# Altium schematic sheet Sheet2.SchDoc
size 431 x 279 mm; SheetNumber: 1; SheetTotal: 1
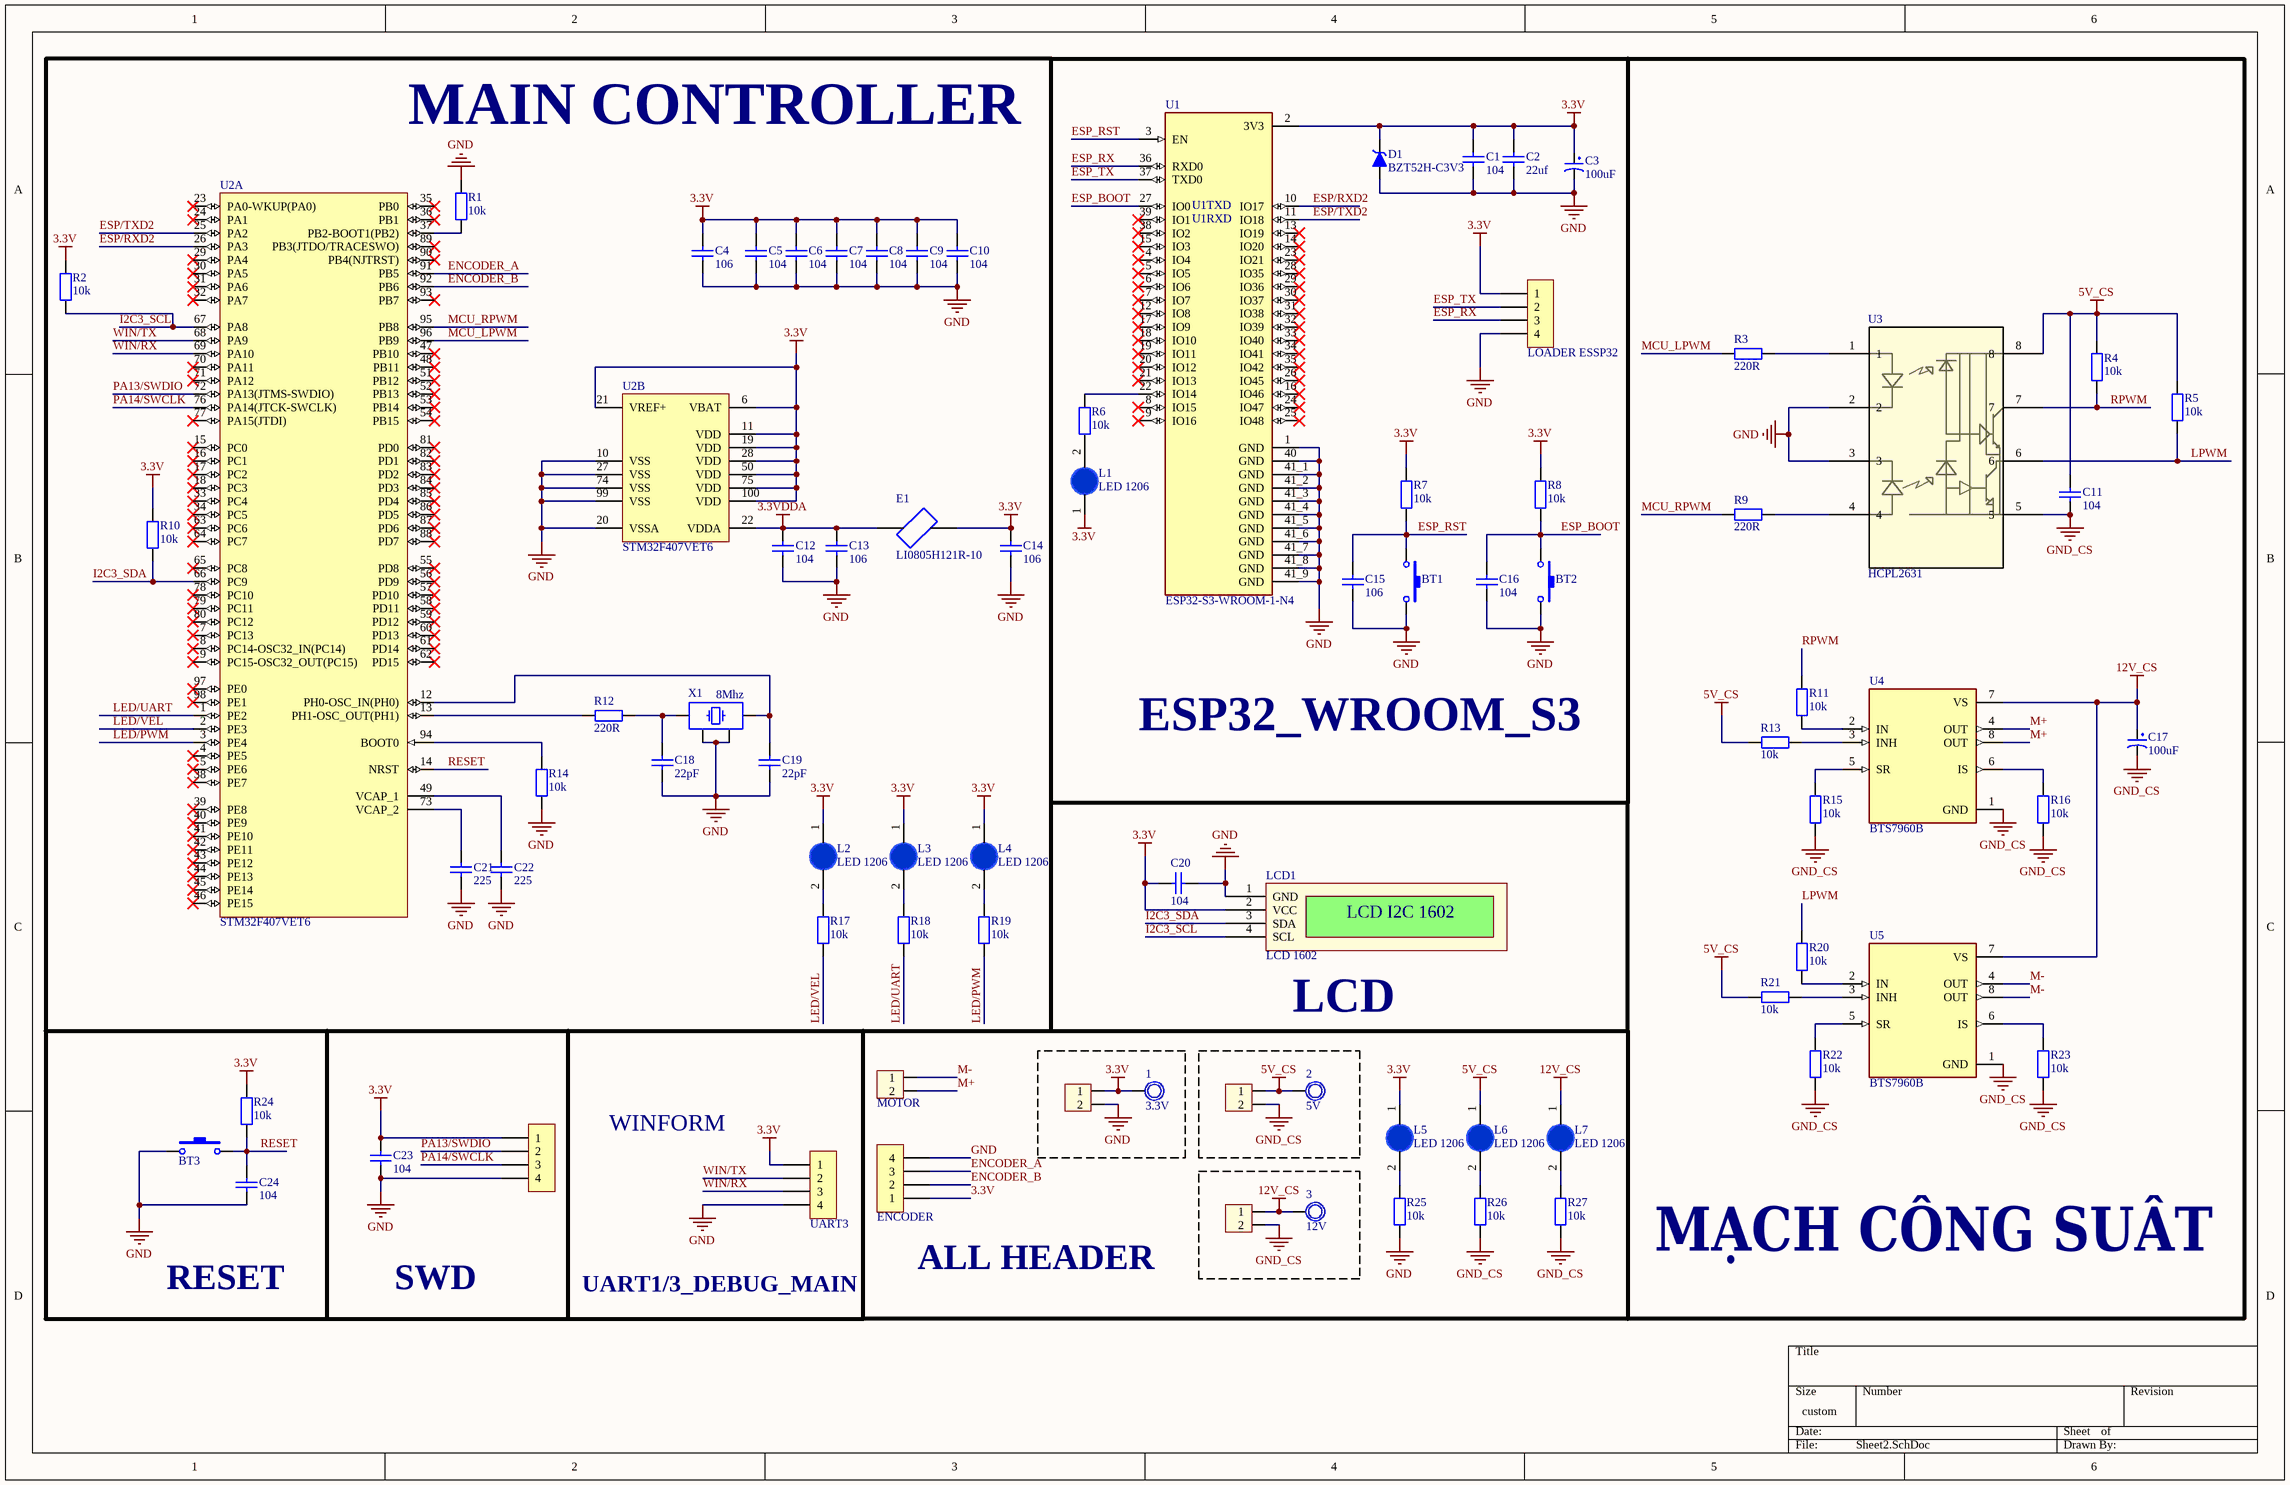
[diagram p0: Sheet2.SchDoc]

## Parts
1  3.3V  [TP1]
2  5V  [TP1]
3  12V  [TP1]
BT1  Nut Nhan 2 Chan SMD 3x6x2.5  [Nut Nhan 2 Chan SMD 3x6x2.5]  (value not drawn)
BT2  Nut Nhan 2 Chan SMD 3x6x2.5  [Nut Nhan 2 Chan SMD 3x6x2.5]  (value not drawn)
BT3  Nut Nhan 2 Chan SMD 3x6x2.5  [Nut Nhan 2 Chan SMD 3x6x2.5]  (value not drawn)
C1  104  [tu 0805]
C2  22uf  [tu 0805]
C3  100uF  [tu tantalum smd7343]
C4  106  [tu 0805]
C5  104  [tu 0805]
C6  104  [tu 0805]
C7  104  [tu 0805]
C8  104  [tu 0805]
C9  104  [tu 0805]
C10  104  [tu 0805]
C11  104  [tu 0805]
C12  104  [tu 0805]
C13  106  [tu 0805]
C14  106  [tu 0805]
C15  106  [tu 0805]
C16  104  [tu 0805]
C17  100uF  [tu hoa 8mm]
C18  22pF  [tu 0805]
C19  22pF  [tu 0805]
C20  104  [tu 0805]
C21  225  [tu 0805]
C22  225  [tu 0805]
C23  104  [tu 0805]
C24  104  [tu 0805]
D1  BZT52H-C3V3  [SOD123]
E1  LI0805H121R-10  [FB_LI0805H121R-10]
H1  LOADER ESSP32  [XH2.54M-4]
H2  MOTOR  [XH2.54M-2]
H3  Header 2P 2.54 Duc Thang  [XH2.54M-2]  (value not drawn)
H4  Header 2P 2.54 Duc Thang  [XH2.54M-2]  (value not drawn)
H5  Header 4P 2.54 Duc Thang  [XH2.54M-4]  (value not drawn)
H6  ENCODER  [XH2.54M-4]
H7  UART3  [XH2.54M-4]
H8  Header 2P 2.54 Duc Thang  [XH2.54M-2]  (value not drawn)
L1  LED 1206  [LED-1206-Blue]
L2  LED 1206  [LED-1206-Blue]
L3  LED 1206  [LED-1206-Blue]
L4  LED 1206  [LED-1206-Blue]
L5  LED 1206  [LED-1206-Blue]
L6  LED 1206  [LED-1206-Blue]
L7  LED 1206  [LED-1206-Blue]
LCD1  LCD 1602  [LCD-I2C-1602]
R1  10k  [tro smd 0805]
R2  10k  [tro smd 0805]
R3  220R  [tro smd 0805]
R4  10k  [tro smd 0805]
R5  10k  [tro smd 0805]
R6  10k  [tro smd 0805]
R7  10k  [tro smd 0805]
R8  10k  [tro smd 0805]
R9  220R  [tro smd 0805]
R10  10k  [tro smd 0805]
R11  10k  [tro smd 0805]
R12  220R  [tro smd 0805]
R13  10k  [tro smd 0805]
R14  10k  [tro smd 0805]
R15  10k  [tro smd 0805]
R16  10k  [tro smd 0805]
R17  10k  [tro smd 0805]
R18  10k  [tro smd 0805]
R19  10k  [tro smd 0805]
R20  10k  [tro smd 0805]
R21  10k  [tro smd 0805]
R22  10k  [tro smd 0805]
R23  10k  [tro smd 0805]
R24  10k  [tro smd 0805]
R25  10k  [tro smd 0805]
R26  10k  [tro smd 0805]
R27  10k  [tro smd 0805]
U1  ESP32-S3-WROOM-1-N4  [XCVR_ESP32-S3-WROOM-1-N4]
U2  STM32F407VET6  [STM-LQFP100_N]  (parts A,B of 2)
U3  HCPL2631  [DIP_PL2631_ONS]
U4  BTS7960B  [DPAK127P1490X440-8N]
U5  BTS7960B  [DPAK127P1490X440-8N]
X1  8Mhz  [XTAL_3225]

## Nets
3.3V: 1.1 C1.1 C2.2 C3.1 C4.1 C5.1 C6.1 C7.1 C8.1 C9.1 C10.1 C14.1 C20.1 C23.1 D1.2(K) E1.2 H1.1 H3.1 H5.1 H6.1 H7.1 L1.1(A) L2.1(A) L3.1(A) L4.1(A) L5.1(A) LCD1.2(VCC) R2.1 R7.2 R8.2 R10.2 R24.2 U1.2(3V3) U2.6(VBAT) U2.11(VDD) U2.19(VDD) U2.21(VREF+) U2.28(VDD) U2.50(VDD) U2.75(VDD) U2.100(VDD)
3.3VDDA: C12.1 C13.1 E1.1 U2.22(VDDA)
5V_CS: 2.1 C11.1 H4.1 L6.1(A) R4.2 R5.2 R13.2 R21.2 U3.8
12V_CS: 3.1 C17.1 H8.1 L7.1(A) U4.7(VS) U5.7(VS)
GND: BT1.2 BT2.2 BT3.1 C1.2 C2.1 C3.2 C4.2 C5.2 C6.2 C7.2 C8.2 C9.2 C10.2 C12.2 C13.2 C14.2 C15.2 C16.2 C18.2 C19.2 C20.2 C21.2 C22.2 C23.2 C24.2 D1.1(A) H1.4 H3.2 H5.4 H6.4 H7.4 LCD1.1(GND) R1.1 R14.1 R25.1 U1.1(GND) U1.40(GND) U1.41_1(GND) U1.41_2(GND) U1.41_3(GND) U1.41_4(GND) U1.41_5(GND) U1.41_6(GND) U1.41_7(GND) U1.41_8(GND) U1.41_9(GND) U2.10(VSS) U2.20(VSSA) U2.27(VSS) U2.74(VSS) U2.99(VSS) U3.2 U3.3 X1.2 X1.4
GND_CS: C11.2 C17.2 H4.2 H8.2 R15.2 R16.2 R22.2 R23.2 R26.1 R27.1 U3.5 U4.1(GND) U5.1(GND)
ENCODER_A: H6.3 U2.91(PB5)
ENCODER_B: H6.2 U2.92(PB6)
ESP/RXD2: U1.10(IO17) U2.26(PA3)
ESP/TXD2: U1.11(IO18) U2.25(PA2)
ESP_BOOT: BT2.1 C16.1 R8.1 U1.27(IO0)
ESP_RST: BT1.1 C15.1 R7.1 U1.3(EN)
ESP_RX: H1.3 U1.36(RXD0)
ESP_TX: H1.2 U1.37(TXD0)
I2C3_SCL: LCD1.4(SCL) R2.2 U2.67(PA8)
I2C3_SDA: LCD1.3(SDA) R10.1 U2.66(PC9)
LED/PWM: R19.1 U2.3(PE4)
LED/UART: R18.1 U2.1(PE2)
LED/VEL: R17.1 U2.2(PE3)
LPWM: R5.1 R20.2 U3.6
M+: H2.2 U4.4(OUT) U4.8(OUT)
M-: H2.1 U5.4(OUT) U5.8(OUT)
MCU_LPWM: R3.1 U2.96(PB9)
MCU_RPWM: R9.1 U2.95(PB8)
PA13/SWDIO: H5.2 U2.72(PA13(JTMS-SWDIO))
PA14/SWCLK: H5.3 U2.76(PA14(JTCK-SWCLK))
RESET: BT3.2 C24.1 R24.1 U2.14(NRST)
RPWM: R4.1 R11.2 U3.7
WIN/RX: H7.3 U2.69(PA10)
WIN/TX: H7.2 U2.68(PA9)
NetC18_1: C18.1 R12.2 X1.1
NetC19_1: C19.1 U2.12(PH0-OSC_IN(PH0)) X1.3
NetC21_1: C21.1 U2.73(VCAP_2)
NetC22_1: C22.1 U2.49(VCAP_1)
NetL1_2: L1.2(K) R6.2
NetL2_2: L2.2(K) R17.2
NetL3_2: L3.2(K) R18.2
NetL4_2: L4.2(K) R19.2
NetL5_2: L5.2(K) R25.2
NetL6_2: L6.2(K) R26.2
NetL7_2: L7.2(K) R27.2
NetR1_2: R1.2 U2.37(PB2-BOOT1(PB2))
NetR3_2: R3.2 U3.1
NetR6_1: R6.1 U1.22(IO14)
NetR9_2: R9.2 U3.4
NetR11_1: R11.1 U4.2(IN)
NetR12_1: R12.1 U2.13(PH1-OSC_OUT(PH1))
NetR13_1: R13.1 U4.3(INH)
NetR14_2: R14.2 U2.94(BOOT0)
NetR15_1: R15.1 U4.5(SR)
NetR16_1: R16.1 U4.6(IS)
NetR20_1: R20.1 U5.2(IN)
NetR21_1: R21.1 U5.3(INH)
NetR22_1: R22.1 U5.5(SR)
NetR23_1: R23.1 U5.6(IS)

Not connected (* = marked no-connect by the designer): U1 4(IO4)* 5(IO5)* 6(IO6)* 7(IO7)* 8(IO15)* 9(IO16)* 12(IO8)* 13(IO19)* 14(IO20)* 15(IO3)* 16(IO46)* 17(IO9)* 18(IO10)* 19(IO11)* 20(IO12)* 21(IO13)* 23(IO21)* 24(IO47)* 25(IO48)* 26(IO45)* 28(IO35)* 29(IO36)* 30(IO37)* 31(IO38)* 32(IO39)* 33(IO40)* 34(IO41)* 35(IO42)* 38(IO2)* 39(IO1)*; U2 4(PE5)* 5(PE6)* 7(PC13)* 8(PC14-OSC32_IN(PC14))* 9(PC15-OSC32_OUT(PC15))* 15(PC0)* 16(PC1)* 17(PC2)* 18(PC3)* 23(PA0-WKUP(PA0))* 24(PA1)* 29(PA4)* 30(PA5)* 31(PA6)* 32(PA7)* 33(PC4)* 34(PC5)* 35(PB0)* 36(PB1)* 38(PE7)* 39(PE8)* 40(PE9)* 41(PE10)* 42(PE11)* 43(PE12)* 44(PE13)* 45(PE14)* 46(PE15)* 47(PB10)* 48(PB11)* 51(PB12)* 52(PB13)* 53(PB14)* 54(PB15)* 55(PD8)* 56(PD9)* 57(PD10)* 58(PD11)* 59(PD12)* 60(PD13)* 61(PD14)* 62(PD15)* 63(PC6)* 64(PC7)* 65(PC8)* 70(PA11)* 71(PA12)* 77(PA15(JTDI))* 78(PC10)* 79(PC11)* 80(PC12)* 81(PD0)* 82(PD1)* 83(PD2)* 84(PD3)* 85(PD4)* 86(PD5)* 87(PD6)* 88(PD7)* 89(PB3(JTDO/TRACESWO))* 90(PB4(NJTRST))* 93(PB7)* 97(PE0)* 98(PE1)*

## Notes on the sheet
- MAIN CONTROLLER
- (near U1) U1TXD
- (near U1) U1RXD
- ESP32_WROOM_S3
- LCD
- WINFORM
- RESET
- SWD
- UART1/3_DEBUG_MAIN
- (near H6) ALL HEADER
- MẠCH CÔNG SUẤT
- (in symbol LCD 1602) LCD I2C 1602

## Library data of the parts
1-3 = TP1: Test Point; Value: Test Point
BT1-BT3 = Nut Nhan 2 Chan SMD 3x6x2.5: Ma_Hang: MH001036; Ten: Nút Nhấn 2 Chân 3x6x2.5MM SMD
C1 C5-C12 C16 C20 C23 C24 = Tu 0805 104 50V 10%: Dán; Don_Vi: Con; So_Chan: 2; Ten_Linh_Kien: Tụ 0805 104-100nF 10% 50V; Ma_Hang: MH004551; Chung_Loai: Dán; Kieu_Chan: *
C2 = Tu 0805 222 50V 10%: Dán; Don_Vi: Con; So_Chan: 2; Ten_Linh_Kien: Tụ 0805 222-2.2nF 10% 50V; Ma_Hang: MH004557; Chung_Loai: Dán; Kieu_Chan: *
C3 = Tu tantalum 100uF 50V SMD7343: Dán; Don_Vi: Con; So_Chan: 2; Ten_Linh_Kien: Tụ tantalum 107T-100uF 50V SMD7343; Ma_Hang: MH008401; Chung_Loai: Dán; Kieu_Chan: *
C4 C13-C15 = Tu 0805 106 16V 10%: Dán; Ten_Linh_Kien: Tụ 0805 106-10uF 10% 16V; So_Chan: 2; Don_Vi: Con; Ma_Hang: MH004553; Chung_Loai: Dán; Kieu_Chan: *
C17 = Tu Hoa 100uF 35V 8x11: Cắm; Don_Vi: Con; So_Chan: 2; Ten_Linh_Kien: Tụ Hóa 100uF 35V 8x11MM; Ma_Hang: MH002807; Chung_Loai: Cắm; Kieu_Chan: *
C18 C19 = Tu 0805 22pF 50V 10%: Dán; Don_Vi: Con; So_Chan: 2; Ten_Linh_Kien: Tụ 0805 22P 10% 50V; Ma_Hang: MH004560; Chung_Loai: Dán; Kieu_Chan: *
C21 C22 = Tu 0805 225 25V 10%: Dán; Don_Vi: Con; So_Chan: 2; Ten_Linh_Kien: Tụ 0805 225-2.2uF 25V 10%; Ma_Hang: MH007483; Chung_Loai: Dán; Kieu_Chan: *
D1 = Diode Zener: Zener Diode
E1 = LI0805H121R-10: EMI Ferrite Chip Bead, 0805, 800MA, 120Ohms @100MHz, DCR Max 0.150Ohm | Laird Performance Materials LI0805H121R-10; SnapEDA_Link: https://www.snapeda.com/parts/LI0805H121R-10/Laird/view-part/?ref=snap; Package: 0805 Laird; Value: *; MF: Laird; MP: LI0805H121R-10; Check_prices: https://www.snapeda.com/parts/LI0805H121R-10/Laird/view-part/?ref=eda
H1 H5-H7 = Header 4P 2.54 Duc Thang: Cắm; Ten_Linh_Kien: Header 4P XH2.54-4P Đực Thẳng; Don_Vi: Con; Ma_Hang: MH001285; Chung_Loai: Cắm
H2-H4 H8 = Header 2P 2.54 Duc Thang: Cắm; Ten_Linh_Kien: Header 2P XH2.54-2P Đực Thẳng; Don_Vi: Con; Ma_Hang: MH001283; Chung_Loai: Cắm
L1-L7 = LED 1206 Xanh Duong: Dán; Don_Vi: Con; Ma_Hang: MH002333; Ten_Linh_Kien: LED1206 Màu Xanh Dương (Blue); Ghi_Chu: *; Kieu_Chan: *; Chung_Loai: Dán
R1 R2 R6 R10 R14 R17-R19 R24-R27 = Tro 0805 1% 10k: Dán; Don_Vi: Con; So_Chan: 2; Ten_Linh_Kien: Trở 0805 1% 10k; Ma_Hang: MH005473; Chung_Loai: Dán; Kieu_Chan: *
R3 R9 R12 = Tro 0805 5% 220R: Dán; Don_Vi: Con; So_Chan: 2; Ten_Linh_Kien: Trở 0805 5% 220R; Ma_Hang: MH005259; Chung_Loai: Dán; Kieu_Chan: *
R4 R5 R7 R8 R11 R13 R15 R16 R20-R23 = Tro 0805 5% 10k: Dán; Don_Vi: Con; So_Chan: 2; Ten_Linh_Kien: Trở 0805 5% 10k; Ma_Hang: MH005239; Chung_Loai: Dán; Kieu_Chan: *
U1 = ESP32-S3-WROOM-1-N4: MF: {'manufacturer': u'Espressif Systems'}; Package: None; Price: None; Value: *; MP: ESP32-S3-WROOM-1-N4; Availability: Unavailable
U2 = CMP-0243-00016-3: ARM Cortex-M4 32-bit MCU+FPU, 210 DMIPS, 512 kB Flash, 192 kB Internal RAM, 82 I/Os, 100-pin LQFP, -40 to 85 degC, Tray; Manufacturer: STMicroelectronics; Supply Voltage(Vcc) max (V): 3.6; Supply Voltage(Vcc) min (V): 1.8; I/Os (High Current): 82; FLASH Size (Prog) (kB): 512; Operating Frequency(F) (Processor speed) (MHz): 168; D/A Converter: 2x12-bit; Internal RAM Size (kB): 192; PackageReference: LQFP100; Core: ARM Cortex-M4; ComponentLink1URL: http://www.st.com/web/en/home.html; ComponentLink1Description: Manufacturer URL; DatasheetVersion: Rev. 4; Packing: Tray; Mounting Technology: Surface Mount; ComponentLink2Description: Datasheet; ComponentLink2URL: http://www.st.com/st-web-ui/static/active/en/resource/technical/document/datasheet/DM00037051.pdf; ComponentLink3Description: Package Specification; PartNumber: STM32F407VET6; PackageVersion: Rev. 1, 06/2013; PackageDescription: 100-Pin Low Profile Quad Flat Package, 14 x 14 mm Body, 0.5 mm Pitch; ComponentLink3URL: http://www.st.com/st-web-ui/static/active/en/resource/technical/document/data_brief/DM00071938.pdf
U3 = HCPL2631: Description; Manufacturer_Name: onsemi; Copyright: Copyright (C) 2025 Ultra Librarian. All rights reserved.; Manufacturer_Part_Number: HCPL2631; RefDes: RefDes; Type: Type
U4 U5 = BTS7960B: Half Bridge Driver DC Motors, General Purpose DMOS PG-TO263-7-1; MF: Infineon; SnapEDA_Link: https://www.snapeda.com/parts/BTS7960B/Infineon/view-part/?ref=snap; Package: TO-263 Infineon; Value: *; MP: BTS7960B; Check_prices: https://www.snapeda.com/parts/BTS7960B/Infineon/view-part/?ref=eda
X1 = TSX-3225_24.0000MF15X-AC: Crystal SMD 24MHz 10PPM 7pF 3225; Manufacturer: Epson; Manufacturer Part Number: TSX-3225 24.0000MF15X-AC